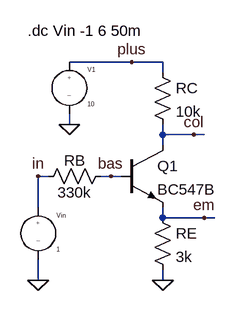
[diagram p0: schematic uk_17.asc]
uk_17.asc, the LTspice schematic file:
Version 4
SHEET 1 880 680
WIRE 176 -32 80 -32
WIRE 224 -32 176 -32
WIRE 224 -16 224 -32
WIRE 80 64 80 48
WIRE 224 80 224 64
WIRE 272 80 224 80
WIRE 288 80 272 80
WIRE 224 96 224 80
WIRE 48 144 32 144
WIRE 144 144 128 144
WIRE 160 144 144 144
WIRE 32 192 32 144
WIRE 224 208 224 192
WIRE 288 208 224 208
WIRE 304 208 288 208
WIRE 32 304 32 272
WIRE 224 304 224 288
FLAG 224 304 0
FLAG 272 80 col
FLAG 144 144 bas
FLAG 176 -32 plus
FLAG 32 304 0
FLAG 288 208 em
FLAG 80 64 0
FLAG 32 144 in
SYMBOL EIT_Semiconductors\\npn 160 96 R0
SYMATTR InstName Q1
SYMATTR Value BC547B
SYMBOL res 32 160 R270
WINDOW 0 25 56 VTop 2
WINDOW 3 7 56 VBottom 2
SYMATTR InstName RB
SYMATTR Value 330k
SYMBOL res 208 -32 R0
SYMATTR InstName RC
SYMATTR Value 10k
SYMBOL res 208 192 R0
SYMATTR InstName RE
SYMATTR Value 3k
SYMBOL source-V 32 176 R0
SYMATTR InstName Vin
SYMATTR Value 1
SYMBOL source-V 80 -48 R0
SYMATTR InstName V1
SYMATTR Value 10
TEXT 16 -80 Left 2 !.dc Vin -1 6 50m

The netlist it stands for:
* uk_17.asc
Q1 col bas em 0 BC547B
RB in bas 330k
RC plus col 10k
RE em 0 3k
Vin in 0 1
V1 plus 0 10
.model NPN NPN
.model PNP PNP
.lib standard.bjt
.dc Vin -1 6 50m
.backanno
.end